# EAGLE schematic SA (EAGLE 9.6.2)
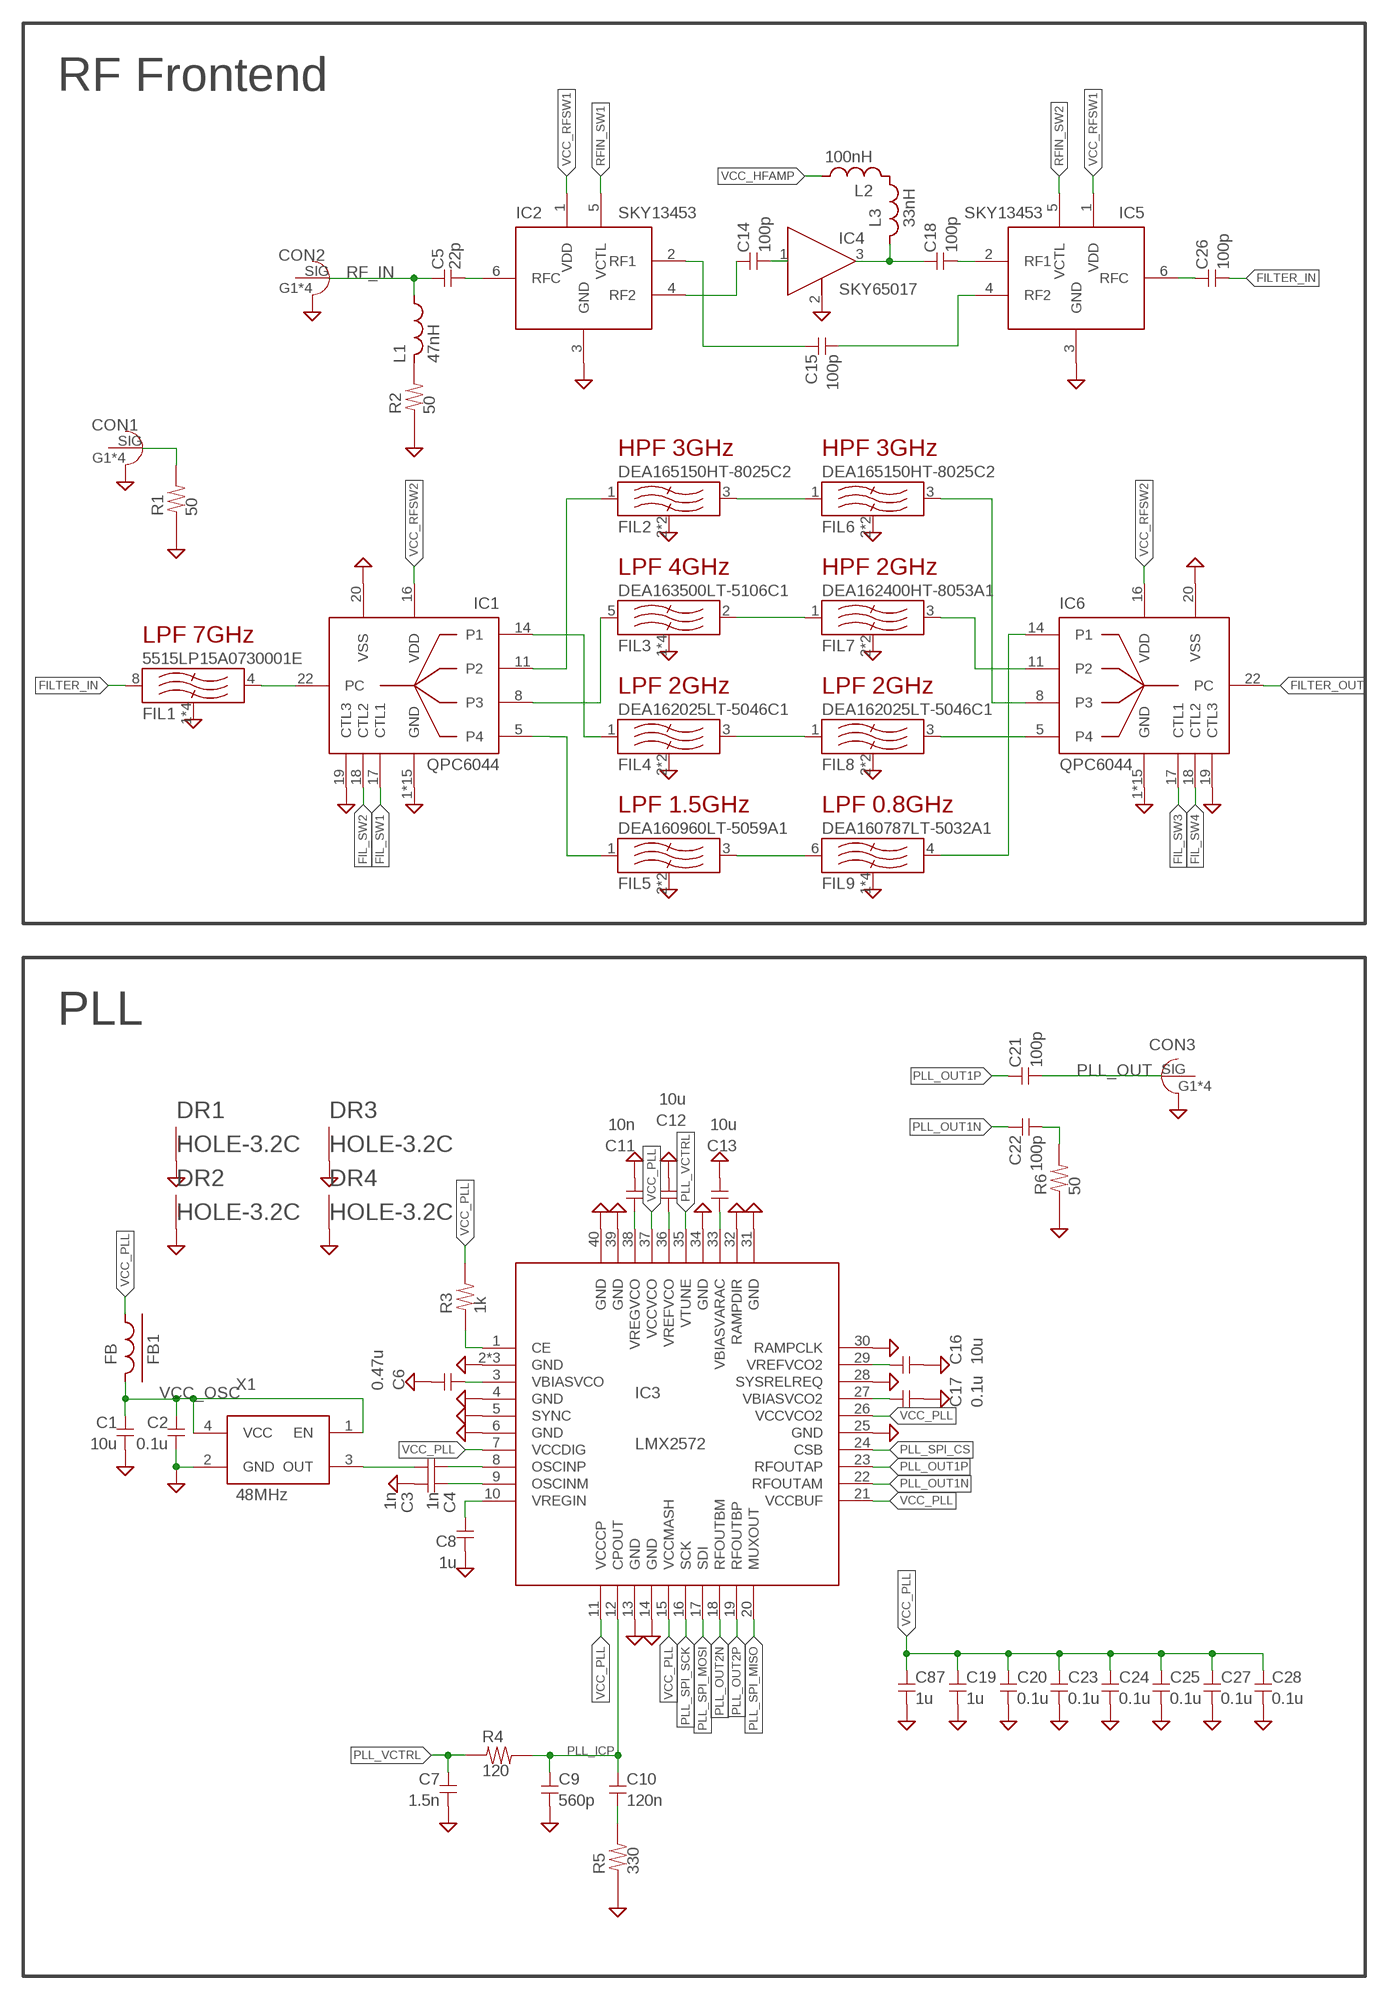
[diagram p0: schematic, sheet 1, part 1 of 2]
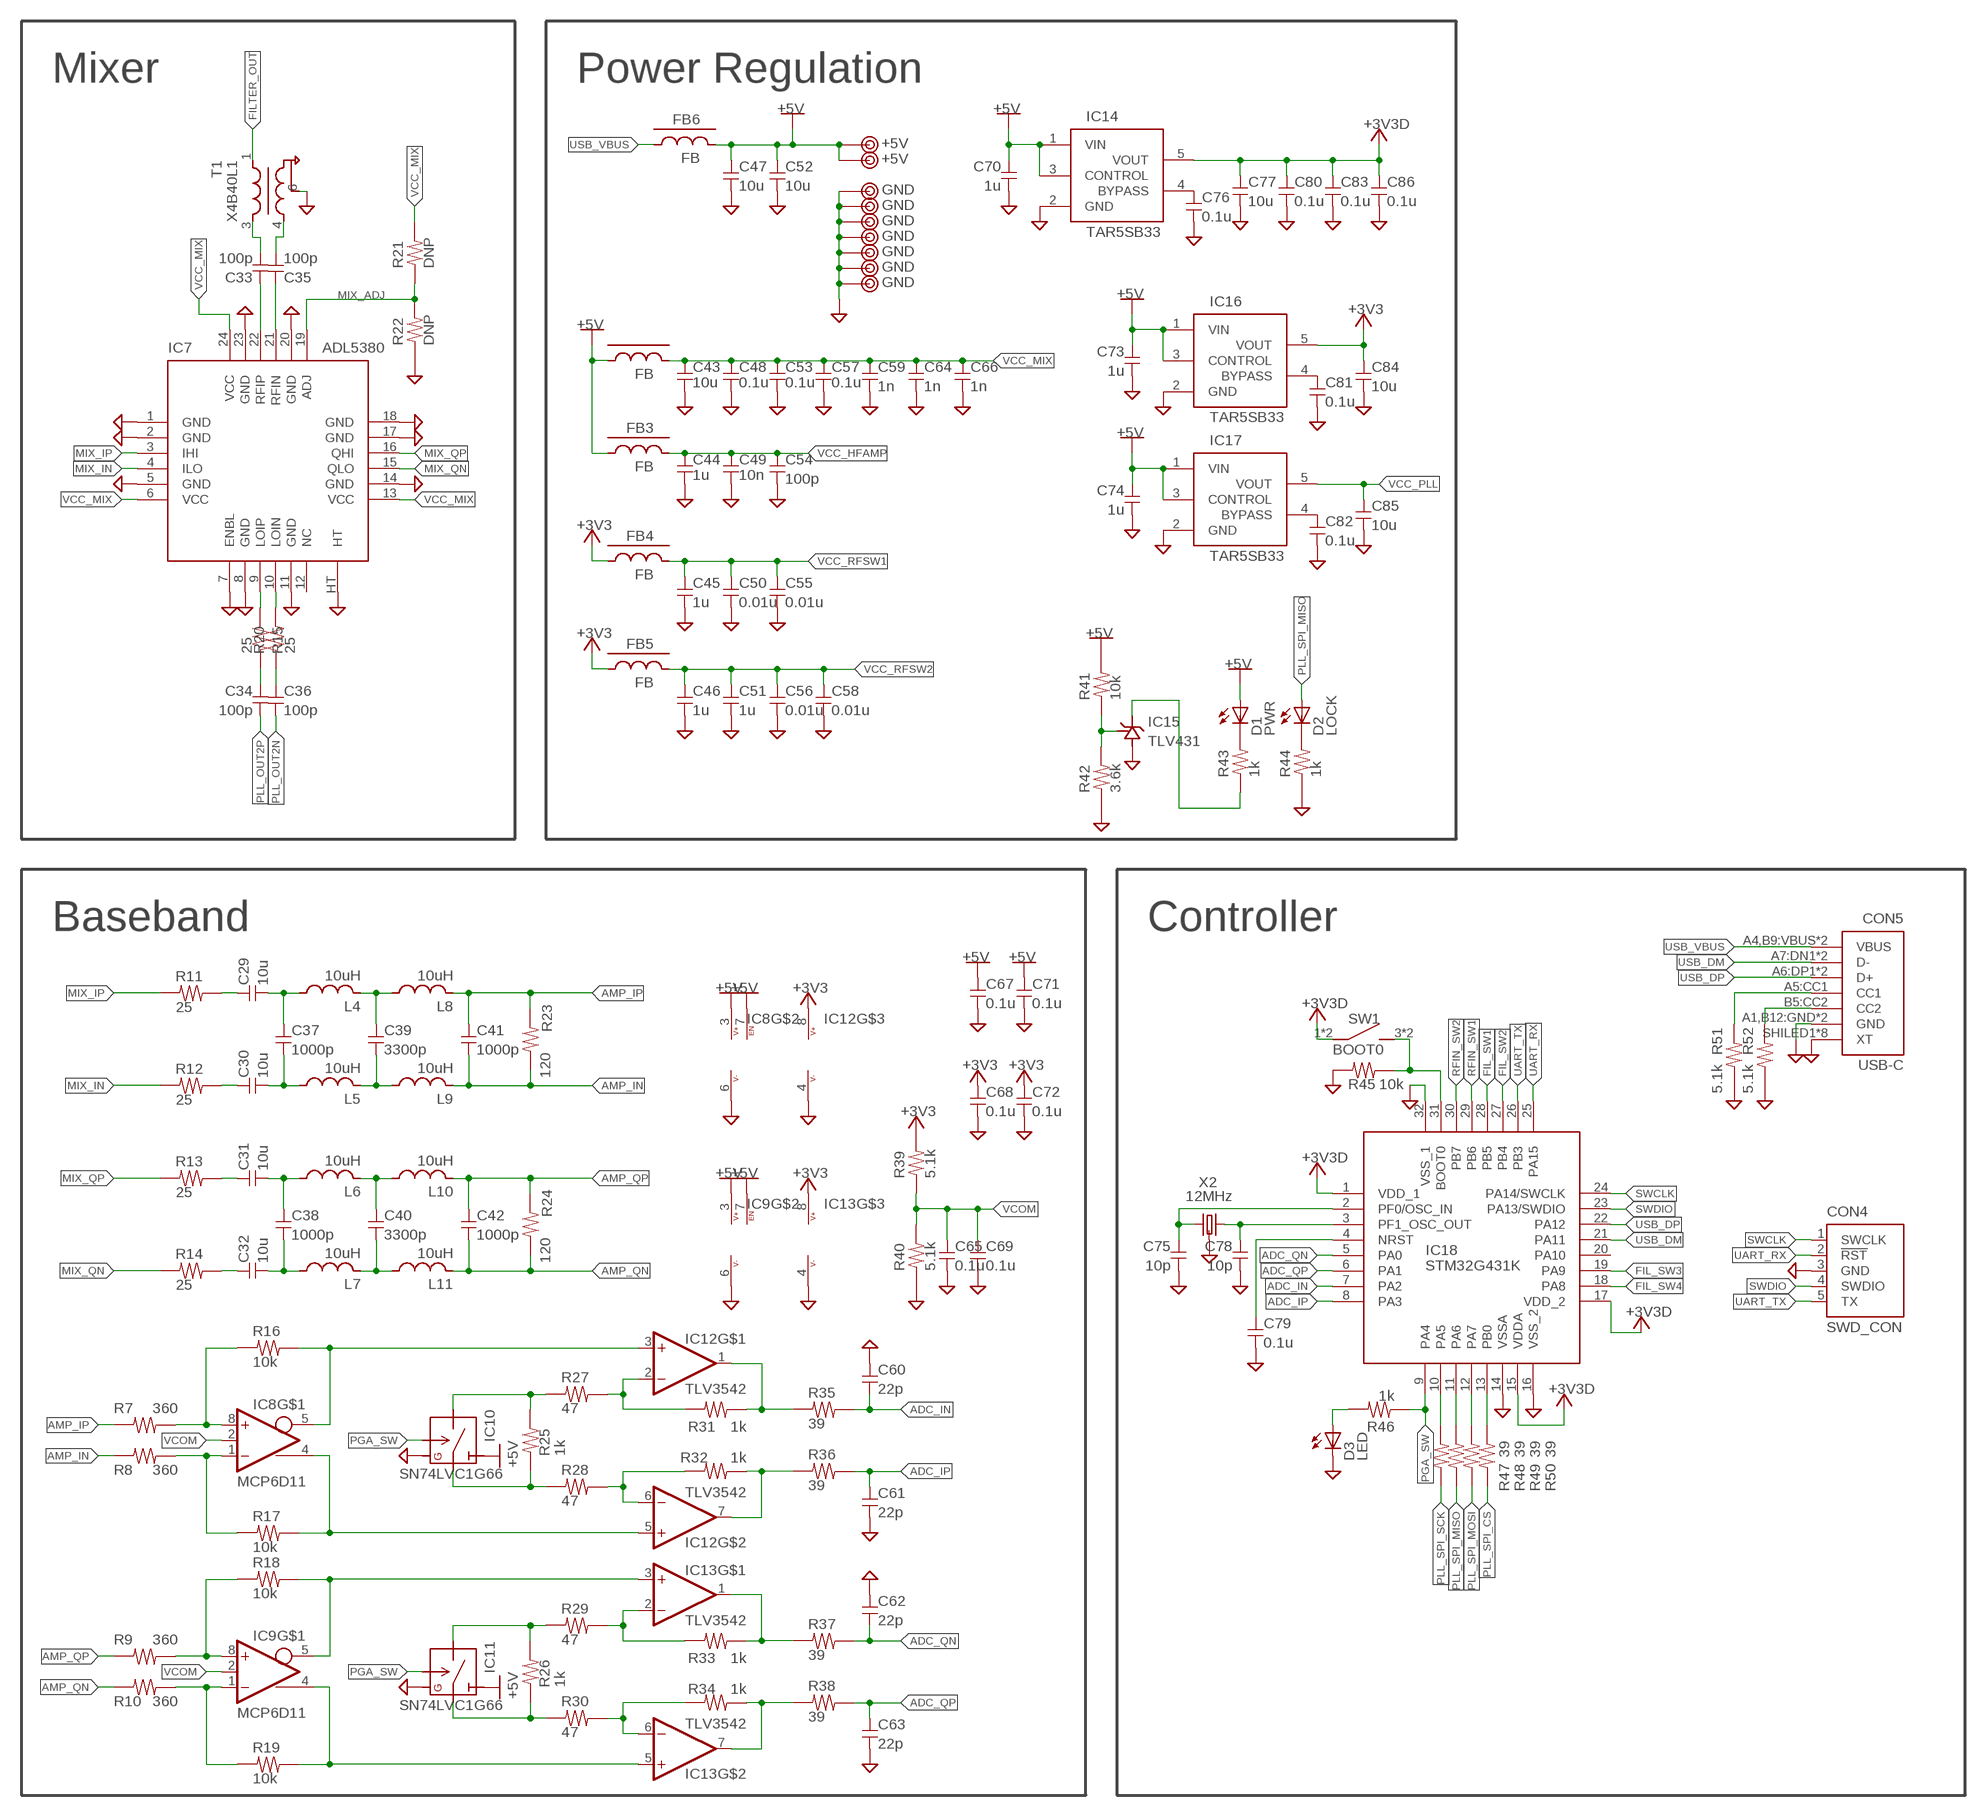
[diagram p1: schematic, sheet 1, part 2 of 2]

## Parts
C1  10u  C-2012  [2012]
C2  0.1u  C-1608  [1608C]
C3  1n  C-1005  [1005]
C4  1n  C-1005  [1005]
C5  22p  C-1005RF  [1005RF]
C6  0.47u  C-1608  [1608C]
C7  1.5n  C-1608  [1608C]
C8  1u  C-1608  [1608C]
C9  560p  C-1608  [1608C]
C10  120n  C-1608  [1608C]
C11  10n  C-1608  [1608C]
C12  10u  C-1608  [1608C]
C13  10u  C-1608  [1608C]
C14  100p  C-1005RF  [1005RF]
C15  100p  C-1005RF  [1005RF]
C16  10u  C-1608  [1608C]
C17  0.1u  C-1608  [1608C]
C18  100p  C-1005RF  [1005RF]
C19  1u  C-1608  [1608C]
C20  0.1u  C-1608  [1608C]
C21  100p  C-1005RF  [1005RF]
C22  100p  C-1005RF  [1005RF]
C23  0.1u  C-1608  [1608C]
C24  0.1u  C-1608  [1608C]
C25  0.1u  C-1608  [1608C]
C26  100p  C-1005RF  [1005RF]
C27  0.1u  C-1608  [1608C]
C28  0.1u  C-1608  [1608C]
C29  10u  C-1608  [1608C]
C30  10u  C-1608  [1608C]
C31  10u  C-1608  [1608C]
C32  10u  C-1608  [1608C]
C33  100p  C-1005RF  [1005RF]
C34  100p  C-1005RF  [1005RF]
C35  100p  C-1005RF  [1005RF]
C36  100p  C-1005RF  [1005RF]
C37  1000p  C-1608  [1608C]
C38  1000p  C-1608  [1608C]
C39  3300p  C-1608  [1608C]
C40  3300p  C-1608  [1608C]
C41  1000p  C-1608  [1608C]
C42  1000p  C-1608  [1608C]
C43  10u  C-2012  [2012]
C44  1u  C-1608  [1608C]
C45  1u  C-1608  [1608C]
C46  1u  C-1608  [1608C]
C47  10u  C-3216  [3216]
C48  0.1u  C-1608  [1608C]
C49  10n  C-1608  [1608C]
C50  0.01u  C-1608  [1608C]
C51  1u  C-1608  [1608C]
C52  10u  C-2012  [2012]
C53  0.1u  C-1608  [1608C]
C54  100p  C-1005  [1005]
C55  0.01u  C-1608  [1608C]
C56  0.01u  C-1608  [1608C]
C57  0.1u  C-1608  [1608C]
C58  0.01u  C-1608  [1608C]
C59  1n  C-1005  [1005]
C60  22p  C-1608  [1608C]
C61  22p  C-1608  [1608C]
C62  22p  C-1608  [1608C]
C63  22p  C-1608  [1608C]
C64  1n  C-1005  [1005]
C65  0.1u  C-1608  [1608C]
C66  1n  C-1005  [1005]
C67  0.1u  C-1608  [1608C]
C68  0.1u  C-1608  [1608C]
C69  0.1u  C-1608  [1608C]
C70  1u  C-1608  [1608C]
C71  0.1u  C-1608  [1608C]
C72  0.1u  C-1608  [1608C]
C73  1u  C-1608  [1608C]
C74  1u  C-1608  [1608C]
C75  10p  C-1608  [1608C]
C76  0.1u  C-1608  [1608C]
C77  10u  C-2012  [2012]
C78  10p  C-1608  [1608C]
C79  0.1u  C-1608  [1608C]
C80  0.1u  C-1608  [1608C]
C81  0.1u  C-1608  [1608C]
C82  0.1u  C-1608  [1608C]
C83  0.1u  C-1608  [1608C]
C84  10u  C-2012  [2012]
C85  10u  C-2012  [2012]
C86  0.1u  C-1608  [1608C]
C87  1u  C-1608  [1608C]
CON1  DM_L  SMA-142-0701-801  [SMA-EDGE]
CON2  RF_IN  SMA-142-0701-801  [SMA-EDGE]
CON3  PLL_OUT  SMA-142-0701-801  [SMA-EDGE]
CON4  SWD_CON  [SWD_CON]
CON5  USB-C  [5077CR-16-SMC2-BK-TR]
D1  PWR  LED-SMD1608  [D1608]
D2  LOCK  LED-SMD1608  [D1608]
D3  LED  LED-SMD1608  [D1608]
DR1  HOLE-3.2C  [HOLE_3.2_CON2]
DR2  HOLE-3.2C  [HOLE_3.2_CON2]
DR3  HOLE-3.2C  [HOLE_3.2_CON2]
DR4  HOLE-3.2C  [HOLE_3.2_CON2]
FB1  FB  FB-1608FB  [1608-FB]
FB2  FB  FB-1608FB  [1608-FB]
FB3  FB  FB-1608FB  [1608-FB]
FB4  FB  FB-1608FB  [1608-FB]
FB5  FB  FB-1608FB  [1608-FB]
FB6  FB  FB-2012-FB  [2012-R]
FIL1  5515LP15A0730001E  RF-FILTER-2012-JOHANSON  [RF-FILTER-2012-JOHANSON]
FIL2  DEA165150HT-8025C2  RF-FILTER-1608-TDK  [RF-FILTER-1608-TDK]
FIL3  DEA163500LT-5106C1  RF-FILTER-1608-TDK3  [RF-FILTER-1608-TDK2]
FIL4  DEA162025LT-5046C1  RF-FILTER-1608-TDK  [RF-FILTER-1608-TDK]
FIL5  DEA160960LT-5059A1  RF-FILTER-1608-TDK  [RF-FILTER-1608-TDK]
FIL6  DEA165150HT-8025C2  RF-FILTER-1608-TDK  [RF-FILTER-1608-TDK]
FIL7  DEA162400HT-8053A1  RF-FILTER-1608-TDK  [RF-FILTER-1608-TDK]
FIL8  DEA162025LT-5046C1  RF-FILTER-1608-TDK  [RF-FILTER-1608-TDK]
FIL9  DEA160787LT-5032A1  RF-FILTER-1608-TDK2  [RF-FILTER-1608-TDK2]
IC1  QPC6044  [QFN24-QPC6044]
IC2  SKY13453  [SKY13453]
IC3  LMX2572  [QFN40-LMX]
IC4  SKY65017  RF_AMP  [SOT89-RF]
IC5  SKY13453  [SKY13453]
IC6  QPC6044  [QFN24-QPC6044]
IC7  ADL5380  [LFCSP24]
IC8  MCP6D11  OPA-DIFF-MSOP  [MSOP8]
IC9  MCP6D11  OPA-DIFF-MSOP  [MSOP8]
IC10  SN74LVC1G66  [SOT23-5-2]
IC11  SN74LVC1G66  [SOT23-5-2]
IC12  TLV3542  OPA-2-SOP  [SOP8-3]
IC13  TLV3542  OPA-2-SOP  [SOP8-3]
IC14  TAR5SB33  [SOT23-5]
IC15  TLV431  TL431-SC59  [SC59]
IC16  TAR5SB33  [SOT23-5]
IC17  TAR5SB33  [SOT23-5]
IC18  STM32G431K  STM32G431KB  [TQFP32-08]
L1  47nH  L-1005RF  [1005RF]
L2  100nH  L-1608  [1608-L]
L3  33nH  L-1005RF  [1005RF]
L4  10uH  L-2012  [2012-R]
L5  10uH  L-2012  [2012-R]
L6  10uH  L-2012  [2012-R]
L7  10uH  L-2012  [2012-R]
L8  10uH  L-2012  [2012-R]
L9  10uH  L-2012  [2012-R]
L10  10uH  L-2012  [2012-R]
L11  10uH  L-2012  [2012-R]
R1  50  R-1005RF  [1005RF]
R2  50  R-1005RF  [1005RF]
R3  1k  R-1608  [1608]
R4  120  R-1608  [1608]
R5  330  R-1608  [1608]
R6  50  R-1005RF  [1005RF]
R7  360  R-1608  [1608]
R8  360  R-1608  [1608]
R9  360  R-1608  [1608]
R10  360  R-1608  [1608]
R11  25  R-1608  [1608]
R12  25  R-1608  [1608]
R13  25  R-1608  [1608]
R14  25  R-1608  [1608]
R15  25  R-1005RF  [1005RF]
R16  10k  R-1608  [1608]
R17  10k  R-1608-3  [1608-3]
R18  10k  R-1608  [1608]
R19  10k  R-1608-3  [1608-3]
R20  25  R-1005RF  [1005RF]
R21  DNP  R-1608  [1608]
R22  DNP  R-1608  [1608]
R23  120  R-1608  [1608]
R24  120  R-1608  [1608]
R25  1k  R-1608  [1608]
R26  1k  R-1608  [1608]
R27  47  R-1608-3  [1608-3]
R28  47  R-1608-3  [1608-3]
R29  47  R-1608-3  [1608-3]
R30  47  R-1608-3  [1608-3]
R31  1k  R-1608-3  [1608-3]
R32  1k  R-1608-3  [1608-3]
R33  1k  R-1608-3  [1608-3]
R34  1k  R-1608-3  [1608-3]
R35  39  R-1608  [1608]
R36  39  R-1608  [1608]
R37  39  R-1608  [1608]
R38  39  R-1608  [1608]
R39  5.1k  R-1608  [1608]
R40  5.1k  R-1608  [1608]
R41  10k  R-1608  [1608]
R42  3.6k  R-1608  [1608]
R43  1k  R-1608  [1608]
R44  1k  R-1608  [1608]
R45  10k  R-1608  [1608]
R46  1k  R-1608  [1608]
R47  39  R-1608  [1608]
R48  39  R-1608  [1608]
R49  39  R-1608  [1608]
R50  39  R-1608  [1608]
R51  5.1k  R-1608  [1608]
R52  5.1k  R-1608  [1608]
SW1  BOOT0  SW-SMD  [SKRPACE010]
T1  X4B40L1  [X4B40L1]
TP1  +5V  TESTPIN  [TESTPIN]
TP2  GND  TESTPIN  [TESTPIN]
TP3  GND  TESTPIN  [TESTPIN]
TP4  +5V  TESTPIN  [TESTPIN]
TP5  GND  TESTPIN  [TESTPIN]
TP6  GND  TESTPIN  [TESTPIN]
TP7  GND  TESTPIN  [TESTPIN]
TP8  GND  TESTPIN  [TESTPIN]
TP9  GND  TESTPIN  [TESTPIN]
X1  48MHz  OSC-KC3225  [KC3225]
X2  12MHz  CRYSTAL2  [KC3225-CRYSTAL]

## Nets
+3V3: C68.1 C72.1 C84.1 FB4.1 FB5.1 IC12.8(V+) IC13.8(V+) IC16.5(VOUT) R39.2
+3V3D: C77.1 C80.1 C83.1 C86.1 IC14.5(VOUT) IC18.1(VDD_1) IC18.15(VDDA) IC18.17(VDD_2) SW1.1 SW1.2
+5V: C47.1 C52.1 C67.1 C70.1 C71.1 C73.1 C74.1 D1.A FB2.1 FB3.1 FB6.2 IC8.3(V+) IC8.7(EN) IC9.3(V+) IC9.7(EN) IC10.5(VCC) IC11.5(VCC) IC14.1(VIN) IC14.3(CONTROL) IC16.1(VIN) IC16.3(CONTROL) IC17.1(VIN) IC17.3(CONTROL) R41.2 TP1.1 TP4.1
ADC_IN: C60.2 IC18.7(PA2) R35.2
ADC_IP: C61.1 IC18.8(PA3) R36.2
ADC_QN: C62.2 IC18.5(PA0) R37.2
ADC_QP: C63.1 IC18.6(PA1) R38.2
AMP_IN: C41.2 L9.2 R8.1 R23.1
AMP_IP: C41.1 L8.2 R7.1 R23.2
AMP_QN: C42.2 L11.2 R10.1 R24.1
AMP_QP: C42.1 L10.2 R9.1 R24.2
DUMMY_LOAD: CON1.SIG R1.2
FIL_SW1: IC1.17(CTL1) IC18.28(PB5)
FIL_SW2: IC1.18(CTL2) IC18.27(PB4)
FIL_SW3: IC6.17(CTL1) IC18.19(PA9)
FIL_SW4: IC6.18(CTL2) IC18.18(PA8)
FILTER_IN: C26.2 FIL1.8(IN)
FILTER_OUT: IC6.22(PC) T1.1(IN)
GND: C1.2 C2.2 C4.2 C6.2 C7.2 C8.2 C9.2 C11.2 C12.2 C13.2 C16.2 C17.2 C19.2 C20.2 C23.2 C24.2 C25.2 C27.2 C28.2 C43.2 C44.2 C45.2 C46.2 C47.2 C48.2 C49.2 C50.2 C51.2 C52.2 C53.2 C54.2 C55.2 C56.2 C57.2 C58.2 C59.2 C60.1 C61.2 C62.1 C63.2 C64.2 C65.2 C66.2 C67.2 C68.2 C69.2 C70.2 C71.2 C72.2 C73.2 C74.2 C75.2 C76.2 C77.2 C78.2 C79.2 C80.2 C81.2 C82.2 C83.2 C84.2 C85.2 C86.2 C87.2 CON1.G1(GND) CON1.G2(GND) CON1.G3(GND) CON1.G4(GND) CON2.G1(GND) CON2.G2(GND) CON2.G3(GND) CON2.G4(GND) CON3.G1(GND) CON3.G2(GND) CON3.G3(GND) CON3.G4(GND) CON4.3(GND) CON5.A1,B12:GND(GND) CON5.B1,A12:GND(GND) CON5.SHILED1(XT) CON5.SHILED2(XT) CON5.SHILED3(XT) CON5.SHILED4(XT) CON5.SHILED5(XT) CON5.SHILED6(XT) CON5.SHILED7(XT) CON5.SHILED8(XT) D3.K DR1.T(HT) DR2.T(HT) DR3.T(HT) DR4.T(HT) FIL1.1(GND) FIL1.3(GND) FIL1.5(GND) FIL1.7(GND) FIL2.2(GND) FIL2.4(GND) FIL3.1(GND) FIL3.3(GND) FIL3.4(GND) FIL3.6(GND) FIL4.2(GND) FIL4.4(GND) FIL5.2(GND) FIL5.4(GND) FIL6.2(GND) FIL6.4(GND) FIL7.2(GND) FIL7.4(GND) FIL8.2(GND) FIL8.4(GND) FIL9.1(GND) FIL9.2(GND) FIL9.3(GND) FIL9.5(GND) IC1.1(GND) IC1.2(GND) IC1.3(GND) IC1.4(GND) IC1.6(GND) IC1.7(GND) IC1.9(GND) IC1.10(GND) IC1.12(GND) IC1.13(GND) IC1.15(GND) IC1.19(CTL3) IC1.20(VSS) IC1.21(GND) IC1.23(GND) IC1.24(GND) IC1.HT(GND) IC2.3(GND) IC3.2(GND) IC3.4(GND) IC3.5(SYNC) IC3.6(GND) IC3.13(GND) IC3.14(GND) IC3.25(GND) IC3.28(SYSRELREQ) IC3.30(RAMPCLK) IC3.31(GND) IC3.32(RAMPDIR) IC3.34(GND) IC3.39(GND) IC3.40(GND) IC3.HT2(GND) IC3.HT(GND) IC4.2(GND) IC5.3(GND) IC6.1(GND) IC6.2(GND) IC6.3(GND) IC6.4(GND) IC6.6(GND) IC6.7(GND) IC6.9(GND) IC6.10(GND) IC6.12(GND) IC6.13(GND) IC6.15(GND) IC6.19(CTL3) IC6.20(VSS) IC6.21(GND) IC6.23(GND) IC6.24(GND) IC6.HT(GND) IC7.1(GND) IC7.2(GND) IC7.5(GND) IC7.7(ENBL) IC7.8(GND) IC7.11(GND) IC7.14(GND) IC7.17(GND) IC7.18(GND) IC7.20(GND) IC7.23(GND) IC7.HT IC8.6(V-) IC9.6(V-) IC10.3(GND) IC11.3(GND) IC12.4(V-) IC13.4(V-) IC14.2(GND) IC15.3(GND) IC16.2(GND) IC17.2(GND) IC18.14(VSSA) IC18.16(VSS_2) IC18.32(VSS_1) R1.1 R2.1 R5.1 R6.1 R22.1 R40.1 R42.1 R44.1 R45.1 R51.1 R52.1 T1.6(GND) TP2.1 TP3.1 TP5.1 TP6.1 TP7.1 TP8.1 TP9.1 X1.2(GND) X2.2(GND) X2.4(GND)
MIX_ADJ: IC7.19(ADJ) R21.1 R22.2
MIX_IN: IC7.4(ILO) R12.1
MIX_IP: IC7.3(IHI) R11.1
MIX_QN: IC7.15(QLO) R14.1
MIX_QP: IC7.16(QHI) R13.1
N$1: C14.1 IC2.4(RF2)
N$2: C10.2 R5.2
N$3: C39.1 L4.2 L8.1
N$4: C35.2 T1.4(OUTN)
N$5: C13.1 IC3.33(VBIASVARAC)
N$6: C39.2 L5.2 L9.1
N$7: C31.2 C38.1 L6.1
N$8: C33.1 IC7.22(RFIP)
N$9: C32.2 C38.2 L7.1
N$10: C40.1 L6.2 L10.1
N$11: C40.2 L7.2 L11.1
N$12: C16.1 IC3.29(VREFVCO2)
N$13: C82.1 IC17.4(BYPASS)
N$14: L2.2 L3.1
N$15: IC15.1(REF) R41.1 R42.2
N$16: IC15.2(OUT) R43.1
N$17: C34.1 R15.1
N$18: C36.1 R20.1
N$19: IC18.10(PA5) R47.1
N$20: C35.1 IC7.21(RFIN)
N$21: C3.2 X1.3(OUT)
N$22: C81.1 IC16.4(BYPASS)
N$23: L1.2 R2.2
N$24: IC18.11(PA6) R48.1
N$25: IC18.12(PA7) R49.1
N$26: C22.2 R6.2
N$27: IC18.13(PB0) R50.1
N$28: D3.A R46.2
N$29: CON5.B5:CC2(CC2) R52.2
N$30: CON5.A5:CC1(CC1) R51.2
N$32: C29.2 C37.1 L4.1
N$33: C30.2 C37.2 L5.1
N$34: IC7.9(LOIP) R15.2
N$35: IC7.10(LOIN) R20.2
N$36: D1.K R43.2
N$37: D2.K R44.2
N$38: FIL1.4(OUT) IC1.22(PC)
N$39: C15.1 IC2.2(RF1)
N$40: C15.2 IC5.4(RF2)
N$41: C26.1 IC5.6(RFC)
N$42: C5.2 IC2.6(RFC)
N$43: C14.2 IC4.1(IN)
N$44: C18.1 IC4.3(OUT) L3.2
N$45: FIL5.1(IN) IC1.5(P4)
N$46: FIL4.1(IN) IC1.14(P1)
N$47: FIL2.1(IN) IC1.11(P2)
N$48: FIL4.3(OUT) FIL8.1(IN)
N$49: FIL6.3(OUT) IC6.8(P3)
N$50: FIL5.3(OUT) FIL9.6(IN)
N$51: FIL3.2(OUT) FIL7.1(IN)
N$52: FIL7.3(OUT) IC6.11(P2)
N$53: FIL9.4(OUT) IC6.14(P1)
N$54: FIL8.3(OUT) IC6.5(P4)
N$55: C4.1 IC3.9(OSCINM)
N$56: C33.2 T1.3(OUTP)
N$57: C18.2 IC5.2(RF1)
N$58: C29.1 R11.2
N$59: C30.1 R12.2
N$60: C31.1 R13.2
N$61: C32.1 R14.2
N$62: IC8.8(+IN) R7.2 R16.1
N$63: IC8.1(-IN) R8.2 R17.1
N$64: IC8.5(-OUT) IC12.3(+IN) R16.2
N$65: IC13.2(-IN) R29.2 R33.2
N$66: IC9.8(+IN) R9.2 R18.1
N$67: IC9.1(-IN) R10.2 R19.1
N$68: IC12.6(-IN) R28.2 R32.2
N$69: IC9.5(-OUT) IC13.3(+IN) R18.2
N$70: C76.1 IC14.4(BYPASS)
N$71: C75.1 IC18.2(PF0/OSC_IN) X2.3
N$72: C78.1 IC18.3(PF1_OSC_OUT) X2.1
N$73: FIL2.3(OUT) FIL6.1(IN)
N$74: IC12.2(-IN) R27.2 R31.2
N$75: IC8.4(+OUT) IC12.5(+IN) R17.2
N$76: IC12.1(OUT) R31.1 R35.1
N$77: IC9.4(+OUT) IC13.5(+IN) R19.2
N$78: IC13.7(OUT) R34.1 R38.1
N$79: IC12.7(OUT) R32.1 R36.1
N$80: IC13.6(-IN) R30.2 R34.2
N$81: IC13.1(OUT) R33.1 R37.1
N$83: IC10.2(B) R25.1 R28.1
N$84: IC10.1(A) R25.2 R27.1
N$85: IC11.2(B) R26.1 R30.1
N$86: IC11.1(A) R26.2 R29.1
N$87: FIL3.5(IN) IC1.8(P3)
N$88: C3.1 IC3.8(OSCINP)
N$89: C12.1 IC3.36(VREFVCO)
N$90: C11.1 IC3.38(VREGVCO)
N$91: C6.1 IC3.3(VBIASVCO)
N$92: C8.1 IC3.10(VREGIN)
N$93: C17.1 IC3.27(VBIASVCO2)
PGA_SW: IC10.4(S) IC11.4(S) IC18.9(PA4) R46.1
PLL_EN: IC3.1(CE) R3.1
PLL_ICP: C9.1 C10.1 IC3.12(CPOUT) R4.2
PLL_OUT: C21.2 CON3.SIG
PLL_OUT1N: C22.1 IC3.22(RFOUTAM)
PLL_OUT1P: C21.1 IC3.23(RFOUTAP)
PLL_OUT2N: C36.2 IC3.18(RFOUTBM)
PLL_OUT2P: C34.2 IC3.19(RFOUTBP)
PLL_SPI_CS: IC3.24(CSB) R50.2
PLL_SPI_MISO: D2.A IC3.20(MUXOUT) R48.2
PLL_SPI_MOSI: IC3.17(SDI) R49.2
PLL_SPI_SCK: IC3.16(SCK) R47.2
PLL_VCTRL: C7.1 IC3.35(VTUNE) R4.1
RF_IN: C5.1 CON2.SIG L1.1
RFIN_SW1: IC2.5(VCTL) IC18.29(PB6)
RFIN_SW2: IC5.5(VCTL) IC18.30(PB7)
ST_BOOT0: IC18.31(BOOT0) R45.2 SW1.3 SW1.4
ST_NRST: C79.1 IC18.4(NRST)
SWCLK: CON4.1(SWCLK) IC18.24(PA14/SWCLK)
SWDIO: CON4.4(SWDIO) IC18.23(PA13/SWDIO)
UART_RX: CON4.2(!RST) IC18.25(PA15)
UART_TX: CON4.5(TX) IC18.26(PB3)
USB_DM: CON5.A7:DN1(D-) CON5.B7:DN2(D-) IC18.21(PA11)
USB_DP: CON5.A6:DP1(D+) CON5.B6:DP2(D+) IC18.22(PA12)
USB_VBUS: CON5.A4,B9:VBUS(VBUS) CON5.B4,A9:VBUS(VBUS) FB6.1
VCC_HFAMP: C44.1 C49.1 C54.1 FB3.2 L2.1
VCC_MIX: C43.1 C48.1 C53.1 C57.1 C59.1 C64.1 C66.1 FB2.2 IC7.6(VCC) IC7.13(VCC) IC7.24(VCC) R21.2
VCC_OSC: C1.1 C2.1 FB1.2 X1.1(EN) X1.4(VCC)
VCC_PLL: C19.1 C20.1 C23.1 C24.1 C25.1 C27.1 C28.1 C85.1 C87.1 FB1.1 IC3.7(VCCDIG) IC3.11(VCCCP) IC3.15(VCCMASH) IC3.21(VCCBUF) IC3.26(VCCVCO2) IC3.37(VCCVCO) IC17.5(VOUT) R3.2
VCC_RFSW1: C45.1 C50.1 C55.1 FB4.2 IC2.1(VDD) IC5.1(VDD)
VCC_RFSW2: C46.1 C51.1 C56.1 C58.1 FB5.2 IC1.16(VDD) IC6.16(VDD)
VCOM: C65.1 C69.1 IC8.2(CM) IC9.2(CM) R39.1 R40.2
Unconnected: IC7.12(NC) IC18.20(PA10)

## Notes on the sheet
- RF Frontend | Mixer | Power Regulation
- HPF 3GHz | HPF 3GHz
- LPF 4GHz | HPF 2GHz
- LPF 7GHz
- LPF 2GHz | LPF 2GHz
- LPF 1.5GHz | LPF 0.8GHz
- PLL | Baseband | Controller

## Library data of the parts
C1-C87 = my_rcl:C
CON1-CON3 = my_connector:SMA
CON4 = my_connector:SWD_CON
CON5 = my_connector:USB-C
D1-D3 = my_rcl:LED
DR1-DR4 = my_connector:HOLE-3.2C
FB1-FB6 = my_rcl:FB
FIL1-FIL9 = my_rcl:RF-FILTER
IC1 IC6 = my_ic:QPC6044
IC2 IC5 = my_ic:SKY13453
IC3 = my_ic:LMX2572
IC4 = my_ic:RF_AMP
IC7 = my_ic:ADL5380
IC8 IC9 = my_ic:OPA-DIFF
IC10 IC11 = my_ic:SN74LVC1G66
IC12 IC13 = my_ic:OPA-2
IC14 IC16 IC17 = my_ic:TAR5SB33
IC15 = my_ic:TL431
IC18 = my_ic:STM32G431KB
L1-L11 = my_rcl:L
R1-R52 = my_rcl:R
SW1 = my_rcl:SW
T1 = my_rcl:X4B40L1
TP1-TP9 = my_connector:TESTPIN
X1 = my_rcl:OSC
X2 = my_rcl:CRYSTAL2: CRYSTAL